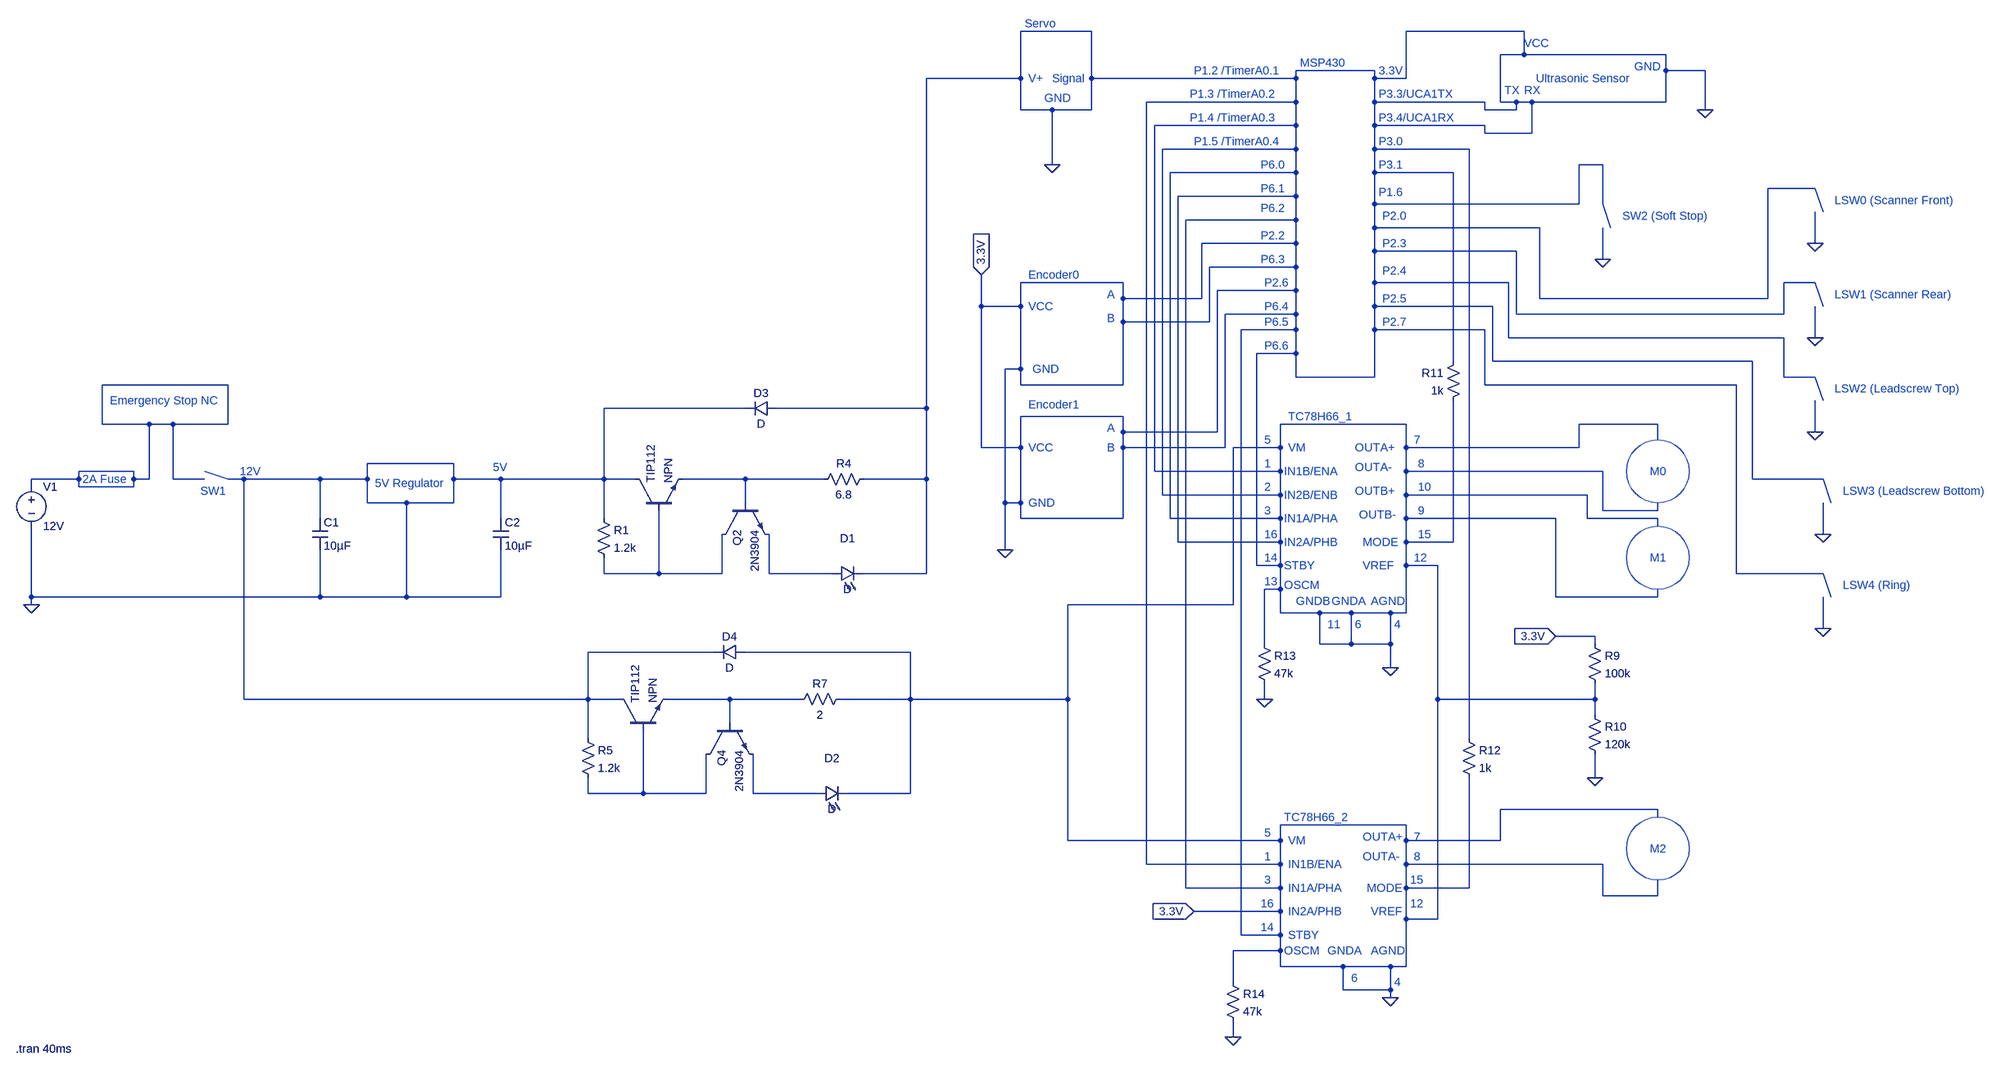
[diagram p0: schematic Project Schematic.asc]
Project Schematic.asc, the LTspice schematic file:
Version 4
SHEET 1 3408 1300
WIRE 1568 -880 1424 -880
WIRE 2448 -880 2208 -880
WIRE 2448 -832 2448 -880
WIRE 2448 -832 2400 -832
WIRE 2736 -832 2448 -832
WIRE 2144 -800 1984 -800
WIRE 2736 -800 2736 -832
WIRE 2816 -800 2736 -800
WIRE 1424 -784 1424 -880
WIRE 1424 -784 1232 -784
WIRE 1568 -784 1568 -880
WIRE 1984 -784 1984 -800
WIRE 1984 -784 1568 -784
WIRE 2144 -784 2144 -800
WIRE 2208 -784 2208 -880
WIRE 2208 -784 2144 -784
WIRE 1984 -736 1984 -784
WIRE 1984 -736 1680 -736
WIRE 2144 -736 2144 -784
WIRE 2368 -736 2144 -736
WIRE 2400 -736 2400 -832
WIRE 2432 -736 2400 -736
WIRE 2464 -736 2432 -736
WIRE 2736 -736 2736 -800
WIRE 2736 -736 2464 -736
WIRE 1424 -720 1424 -784
WIRE 1488 -720 1424 -720
WIRE 1568 -720 1568 -784
WIRE 1568 -720 1488 -720
WIRE 2368 -720 2368 -736
WIRE 2432 -720 2432 -736
WIRE 2432 -720 2368 -720
WIRE 2816 -720 2816 -800
WIRE 1984 -688 1984 -736
WIRE 1984 -688 1696 -688
WIRE 2144 -688 2144 -736
WIRE 2368 -688 2144 -688
WIRE 2368 -672 2368 -688
WIRE 2464 -672 2464 -736
WIRE 2464 -672 2368 -672
WIRE 1984 -640 1984 -688
WIRE 1984 -640 1712 -640
WIRE 2144 -640 2144 -688
WIRE 2336 -640 2144 -640
WIRE 1488 -608 1488 -720
WIRE 2608 -608 2560 -608
WIRE 1984 -592 1984 -640
WIRE 1984 -592 1728 -592
WIRE 2144 -592 2144 -640
WIRE 2304 -592 2144 -592
WIRE 3040 -560 2944 -560
WIRE 1984 -544 1984 -592
WIRE 1984 -544 1744 -544
WIRE 2144 -528 2144 -592
WIRE 2560 -528 2560 -608
WIRE 2560 -528 2144 -528
WIRE 2608 -528 2608 -608
WIRE 3056 -512 3040 -560
WIRE 1984 -496 1984 -544
WIRE 1984 -496 1760 -496
WIRE 2144 -480 2144 -528
WIRE 2480 -480 2144 -480
WIRE 2624 -480 2608 -528
WIRE 1984 -448 1984 -496
WIRE 1984 -448 1792 -448
WIRE 3040 -448 3040 -512
WIRE 2144 -432 2144 -480
WIRE 2432 -432 2144 -432
WIRE 2608 -416 2608 -480
WIRE 1984 -400 1984 -448
WIRE 1984 -400 1808 -400
WIRE 1632 -368 1424 -368
WIRE 2144 -368 2144 -432
WIRE 2416 -368 2144 -368
WIRE 3040 -368 2976 -368
WIRE 1984 -352 1984 -400
WIRE 1984 -352 1824 -352
WIRE 1632 -336 1632 -368
WIRE 1792 -336 1792 -448
WIRE 1792 -336 1632 -336
WIRE 2480 -336 2480 -480
WIRE 2944 -336 2944 -560
WIRE 2944 -336 2480 -336
WIRE 1344 -320 1344 -384
WIRE 1424 -320 1424 -368
WIRE 1424 -320 1344 -320
WIRE 2144 -320 2144 -368
WIRE 2384 -320 2144 -320
WIRE 3056 -320 3040 -368
WIRE 1984 -304 1984 -352
WIRE 1984 -304 1840 -304
WIRE 2432 -304 2432 -432
WIRE 2976 -304 2976 -368
WIRE 2976 -304 2432 -304
WIRE 1632 -288 1632 -336
WIRE 1808 -288 1808 -400
WIRE 1808 -288 1632 -288
WIRE 1984 -272 1984 -304
WIRE 1984 -272 1872 -272
WIRE 2144 -272 2144 -320
WIRE 2368 -272 2144 -272
WIRE 2416 -256 2416 -368
WIRE 2976 -256 2416 -256
WIRE 3040 -256 3040 -320
WIRE 1984 -224 1984 -272
WIRE 1984 -224 1904 -224
WIRE 2304 -208 2304 -592
WIRE 2384 -208 2384 -320
WIRE 2912 -208 2384 -208
WIRE 1424 -192 1424 -320
WIRE 1424 -192 1392 -192
WIRE 1984 -176 1984 -224
WIRE 2144 -176 2144 -272
WIRE 2144 -176 1984 -176
WIRE 2976 -176 2976 -256
WIRE 3040 -176 2976 -176
WIRE -240 -160 -496 -160
WIRE 1424 -160 1424 -192
WIRE 1632 -160 1632 -288
WIRE 1632 -160 1424 -160
WIRE 2368 -160 2368 -272
WIRE 2880 -160 2368 -160
WIRE 3056 -128 3040 -176
WIRE 864 -112 576 -112
WIRE 1232 -112 1232 -784
WIRE 1232 -112 928 -112
WIRE 1632 -96 1424 -96
WIRE -496 -80 -496 -160
WIRE -400 -80 -496 -80
WIRE -352 -80 -400 -80
WIRE -240 -80 -240 -160
WIRE -240 -80 -352 -80
WIRE 2208 -80 1952 -80
WIRE 2720 -80 2560 -80
WIRE 1632 -64 1632 -96
WIRE 1824 -64 1824 -352
WIRE 1824 -64 1632 -64
WIRE 3040 -64 3040 -128
WIRE 2720 -48 2720 -80
WIRE 1344 -32 1344 -320
WIRE 1424 -32 1424 -96
WIRE 1424 -32 1344 -32
WIRE 1632 -32 1632 -64
WIRE 1840 -32 1840 -304
WIRE 1840 -32 1632 -32
WIRE 1952 -32 1952 -80
WIRE 1952 -32 1856 -32
WIRE 2208 -32 2208 -80
WIRE 2560 -32 2560 -80
WIRE 2560 -32 2208 -32
WIRE 224 0 48 0
WIRE -432 16 -544 16
WIRE 1696 16 1696 -688
WIRE 1952 16 1952 -32
WIRE 1952 16 1696 16
WIRE 2208 16 2208 -32
WIRE 2608 16 2208 16
WIRE -544 32 -544 16
WIRE -544 32 -640 32
WIRE -432 32 -432 16
WIRE -400 32 -400 -80
WIRE -400 32 -432 32
WIRE -352 32 -352 -80
WIRE -288 32 -352 32
WIRE -240 32 -288 16
WIRE -208 32 -240 32
WIRE -48 32 -208 32
WIRE 48 32 48 0
WIRE 48 32 -48 32
WIRE 224 32 224 0
WIRE 320 32 224 32
WIRE 576 32 576 -112
WIRE 576 32 320 32
WIRE 640 32 576 32
WIRE 864 32 736 32
WIRE 1024 32 864 32
WIRE 1232 32 1232 -112
WIRE 1232 32 1104 32
WIRE 2912 32 2912 -208
WIRE 3056 32 2912 32
WIRE -640 48 -640 32
WIRE -544 48 -544 32
WIRE -432 48 -432 32
WIRE -432 48 -544 48
WIRE 1712 64 1712 -640
WIRE 1952 64 1952 16
WIRE 1952 64 1712 64
WIRE 2208 64 2208 16
WIRE 2576 64 2208 64
WIRE 48 80 48 32
WIRE 128 80 48 80
WIRE 224 80 224 32
WIRE 224 80 128 80
WIRE 864 80 864 32
WIRE 1392 80 1392 -192
WIRE 1424 80 1424 -32
WIRE 1424 80 1392 80
WIRE 3072 80 3056 32
WIRE 2608 96 2608 16
WIRE 2720 96 2720 80
WIRE 2720 96 2608 96
WIRE -48 112 -48 32
WIRE 320 112 320 32
WIRE 576 112 576 32
WIRE 1424 112 1424 80
WIRE 1632 112 1632 -32
WIRE 1632 112 1424 112
WIRE 1728 112 1728 -592
WIRE 1952 112 1952 64
WIRE 1952 112 1728 112
WIRE 2208 112 2208 64
WIRE 2512 112 2208 112
WIRE 2576 112 2576 64
WIRE 2720 112 2576 112
WIRE 2720 128 2720 112
WIRE 3056 144 3056 80
WIRE 1744 160 1744 -544
WIRE 1952 160 1952 112
WIRE 1952 160 1744 160
WIRE 2208 160 2208 112
WIRE 2304 160 2304 -128
WIRE 2304 160 2208 160
WIRE 1392 176 1392 80
WIRE 1904 208 1904 -224
WIRE 1952 208 1952 160
WIRE 1952 208 1904 208
WIRE 2208 208 2208 160
WIRE 2272 208 2208 208
WIRE 576 224 576 192
WIRE 688 224 688 96
WIRE 688 224 576 224
WIRE 816 224 816 144
WIRE 816 224 688 224
WIRE 912 224 912 144
WIRE 1040 224 912 224
WIRE 1232 224 1232 32
WIRE 1232 224 1104 224
WIRE 2880 224 2880 -160
WIRE 3056 224 2880 224
WIRE 1952 256 1952 208
WIRE 1952 256 1920 256
WIRE -640 272 -640 128
WIRE -48 272 -48 176
WIRE -48 272 -640 272
WIRE 128 272 128 80
WIRE 128 272 -48 272
WIRE 320 272 320 176
WIRE 320 272 128 272
WIRE 2512 272 2512 112
WIRE 2720 272 2720 256
WIRE 2720 272 2512 272
WIRE 3072 272 3056 224
WIRE -640 288 -640 272
WIRE 1856 288 1856 -32
WIRE 1856 288 1520 288
WIRE 1952 304 1952 256
WIRE 2032 304 1952 304
WIRE 2096 304 2032 304
WIRE 2176 304 2096 304
WIRE 2208 304 2208 208
WIRE 2208 304 2176 304
WIRE 3056 336 3056 272
WIRE 2592 352 2512 352
WIRE 1920 368 1920 256
WIRE 2032 368 2032 304
WIRE 2096 368 2096 304
WIRE 2096 368 2032 368
WIRE 2176 368 2176 304
WIRE 2176 368 2096 368
WIRE 2592 368 2592 352
WIRE 800 384 544 384
WIRE 1200 384 864 384
WIRE 2176 416 2176 368
WIRE -208 480 -208 32
WIRE 544 480 544 384
WIRE 544 480 -208 480
WIRE 608 480 544 480
WIRE 832 480 704 480
WIRE 976 480 832 480
WIRE 1200 480 1200 384
WIRE 1200 480 1056 480
WIRE 1520 480 1520 288
WIRE 1520 480 1200 480
WIRE 1920 480 1920 448
WIRE 2272 480 2272 208
WIRE 2592 480 2592 448
WIRE 2592 480 2272 480
WIRE 2592 512 2592 480
WIRE 832 528 832 480
WIRE 544 560 544 480
WIRE 2336 560 2336 -640
WIRE 2592 640 2592 592
WIRE 544 672 544 640
WIRE 656 672 656 544
WIRE 656 672 544 672
WIRE 784 672 784 592
WIRE 784 672 656 672
WIRE 880 672 880 592
WIRE 1008 672 880 672
WIRE 1200 672 1200 480
WIRE 1200 672 1072 672
WIRE 2720 704 2400 704
WIRE 2720 720 2720 704
WIRE 2208 736 1952 736
WIRE 1520 768 1520 480
WIRE 1952 768 1952 736
WIRE 1952 768 1520 768
WIRE 2208 768 2208 736
WIRE 2400 768 2400 704
WIRE 2400 768 2208 768
WIRE 1680 816 1680 -736
WIRE 1952 816 1952 768
WIRE 1952 816 1680 816
WIRE 2208 816 2208 768
WIRE 2608 816 2208 816
WIRE 1760 864 1760 -496
WIRE 1952 864 1952 816
WIRE 1952 864 1760 864
WIRE 2208 864 2208 816
WIRE 2336 864 2336 640
WIRE 2336 864 2208 864
WIRE 2608 880 2608 816
WIRE 2720 880 2720 848
WIRE 2720 880 2608 880
WIRE 1952 912 1952 864
WIRE 1952 912 1776 912
WIRE 2208 928 2208 864
WIRE 2272 928 2272 480
WIRE 2272 928 2208 928
WIRE 1872 960 1872 -272
WIRE 1952 960 1952 912
WIRE 1952 960 1872 960
WIRE 1952 992 1952 960
WIRE 1952 992 1856 992
WIRE 1952 1024 1952 992
WIRE 2080 1024 1952 1024
WIRE 2176 1024 2080 1024
WIRE 2208 1024 2208 928
WIRE 2208 1024 2176 1024
WIRE 1856 1056 1856 992
WIRE 2080 1072 2080 1024
WIRE 2176 1072 2176 1024
WIRE 2176 1072 2080 1072
WIRE 2176 1088 2176 1072
WIRE 1856 1168 1856 1136
FLAG -640 288 0
FLAG 2816 -720 0
FLAG 1488 -608 0
FLAG 2176 416 0
FLAG 2176 1088 0
FLAG 1776 912 3.3V
IOPIN 1776 912 In
FLAG 2512 352 3.3V
IOPIN 2512 352 In
FLAG 2592 640 0
FLAG 2608 -416 0
FLAG 3040 -448 0
FLAG 3040 -256 0
FLAG 3040 -64 0
FLAG 3056 144 0
FLAG 3056 336 0
FLAG 1920 480 0
FLAG 1856 1168 0
FLAG 1344 -384 3.3V
IOPIN 1344 -384 In
FLAG 1392 176 0
SYMBOL voltage -640 32 R0
WINDOW 123 0 0 Left 0
WINDOW 39 0 0 Left 0
SYMATTR InstName V1
SYMATTR Value 12V
SYMBOL cap -64 112 R0
SYMATTR InstName C1
SYMATTR Value 10µF
SYMBOL cap 304 112 R0
SYMATTR InstName C2
SYMATTR Value 10µF
SYMBOL npn 640 96 R270
SYMATTR InstName TIP112
SYMBOL npn 816 80 M90
SYMATTR InstName Q2
SYMATTR Value 2N3904
SYMBOL res 560 96 R0
SYMATTR InstName R1
SYMATTR Value 1.2k
SYMBOL LED 1040 240 R270
WINDOW 0 72 32 VTop 2
WINDOW 3 0 32 VBottom 2
SYMATTR InstName D1
SYMBOL res 1120 16 R90
WINDOW 0 0 56 VBottom 2
WINDOW 3 32 56 VTop 2
SYMATTR InstName R4
SYMATTR Value 6.8
SYMBOL npn 608 544 R270
SYMATTR InstName TIP112
SYMBOL npn 784 528 M90
SYMATTR InstName Q4
SYMATTR Value 2N3904
SYMBOL res 528 544 R0
SYMATTR InstName R5
SYMATTR Value 1.2k
SYMBOL LED 1008 688 R270
WINDOW 0 72 32 VTop 2
WINDOW 3 0 32 VBottom 2
SYMATTR InstName D2
SYMBOL res 1072 464 R90
WINDOW 0 0 56 VBottom 2
WINDOW 3 32 56 VTop 2
SYMATTR InstName R7
SYMATTR Value 2
SYMBOL res 2576 352 R0
SYMATTR InstName R9
SYMATTR Value 100k
SYMBOL res 2576 496 R0
SYMATTR InstName R10
SYMATTR Value 120k
SYMBOL res 2320 -224 M0
SYMATTR InstName R11
SYMATTR Value 1k
SYMBOL res 2320 544 R0
SYMATTR InstName R12
SYMATTR Value 1k
SYMBOL res 1904 352 R0
SYMATTR InstName R13
SYMATTR Value 47k
SYMBOL res 1840 1040 R0
SYMATTR InstName R14
SYMATTR Value 47k
SYMBOL diode 928 -128 R90
WINDOW 0 0 32 VBottom 2
WINDOW 3 32 32 VTop 2
SYMATTR InstName D3
SYMBOL diode 864 368 R90
WINDOW 0 0 32 VBottom 2
WINDOW 3 32 32 VTop 2
SYMATTR InstName D4
TEXT 1992 -816 Left 2 ;MSP430
TEXT 64 40 Left 2 ;5V Regulator
TEXT 1432 -896 Left 2 ;Servo
TEXT 1440 -784 Left 2 ;V+
TEXT 1472 -744 Left 2 ;GND
TEXT 1488 -784 Left 2 ;Signal
TEXT 1776 -800 Left 2 ;P1.2 /TimerA0.1
TEXT 2472 -784 Left 2 ;Ultrasonic Sensor
TEXT 2152 -800 Left 2 ;3.3V
TEXT 2448 -856 Left 2 ;VCC
TEXT 2152 -752 Left 2 ;P3.3/UCA1TX
TEXT 2152 -704 Left 2 ;P3.4/UCA1RX
TEXT 2408 -760 Left 2 ;TX
TEXT 2448 -760 Left 2 ;RX
TEXT 2672 -808 Left 2 ;GND
TEXT 1968 -96 Left 2 ;TC78H66_1
TEXT 1960 720 Left 2 ;TC78H66_2
TEXT 1920 -48 Left 2 ;5
TEXT 1920 752 Left 2 ;5
TEXT 1968 -32 Left 2 ;VM
TEXT 1968 768 Left 2 ;VM
TEXT 2136 280 Left 2 ;AGND
TEXT 2136 992 Left 2 ;AGND
TEXT 2184 328 Left 2 ;4
TEXT 2184 1056 Left 2 ;4
TEXT 2104 328 Left 2 ;6
TEXT 2048 328 Left 2 ;11
TEXT 2096 1048 Left 2 ;6
TEXT 2056 280 Left 2 ;GNDA
TEXT 1984 280 Left 2 ;GNDB
TEXT 2048 992 Left 2 ;GNDA
TEXT 2104 -32 Left 2 ;OUTA+
TEXT 2104 8 Left 2 ;OUTA-
TEXT 2104 56 Left 2 ;OUTB+
TEXT 2112 104 Left 2 ;OUTB-
TEXT 2704 16 Left 2 ;M0
TEXT 2704 192 Left 2 ;M1
TEXT 2704 784 Left 2 ;M2
TEXT 2120 760 Left 2 ;OUTA+
TEXT 2120 800 Left 2 ;OUTA-
TEXT 2224 -48 Left 2 ;7
TEXT 2232 0 Left 2 ;8
TEXT 2232 48 Left 2 ;10
TEXT 2232 96 Left 2 ;9
TEXT 2224 760 Left 2 ;7
TEXT 2224 800 Left 2 ;8
TEXT 1768 -752 Left 2 ;P1.3 /TimerA0.2
TEXT 1768 -704 Left 2 ;P1.4 /TimerA0.3
TEXT 1776 -656 Left 2 ;P1.5 /TimerA0.4
TEXT 1920 0 Left 2 ;1
TEXT 1920 48 Left 2 ;2
TEXT 1960 16 Left 2 ;IN1B/ENA
TEXT 1960 64 Left 2 ;IN2B/ENB
TEXT 1968 816 Left 2 ;IN1B/ENA
TEXT 1920 800 Left 2 ;1
TEXT 1960 112 Left 2 ;IN1A/PHA
TEXT 1960 160 Left 2 ;IN2A/PHB
TEXT 1920 96 Left 2 ;3
TEXT 1920 144 Left 2 ;16
TEXT 1912 -608 Left 2 ;P6.0
TEXT 1912 -560 Left 2 ;P6.1
TEXT 1968 864 Left 2 ;IN1A/PHA
TEXT 1968 912 Left 2 ;IN2A/PHB
TEXT 1912 -520 Left 2 ;P6.2
TEXT 2120 160 Left 2 ;MODE
TEXT 2128 864 Left 2 ;MODE
TEXT 2232 144 Left 2 ;15
TEXT 2216 848 Left 2 ;15
TEXT 1920 848 Left 2 ;3
TEXT 1912 896 Left 2 ;16
TEXT 2152 -656 Left 2 ;P3.0
TEXT 2152 -608 Left 2 ;P3.1
TEXT 2120 208 Left 2 ;VREF
TEXT 2136 912 Left 2 ;VREF
TEXT 2216 896 Left 2 ;12
TEXT 2224 192 Left 2 ;12
TEXT -480 -128 Left 2 ;Emergency Stop NC
TEXT -296 56 Left 2 ;SW1
TEXT 2152 -552 Left 2 ;P1.6
TEXT 2648 -504 Left 2 ;SW2 (Soft Stop)
TEXT 3080 -536 Left 2 ;LSW0 (Scanner Front)
TEXT 3080 -344 Left 2 ;LSW1 (Scanner Rear)
TEXT 3080 -152 Left 2 ;LSW2 (Leadscrew Top)
TEXT 3096 56 Left 2 ;LSW3 (Leadscrew Bottom)
TEXT 3096 248 Left 2 ;LSW4 (Ring)
TEXT 2160 -504 Left 2 ;P2.0
TEXT 2160 -448 Left 2 ;P2.3
TEXT 2160 -392 Left 2 ;P2.4
TEXT 2160 -336 Left 2 ;P2.5
TEXT 2160 -288 Left 2 ;P2.7
TEXT 1968 960 Left 2 ;STBY
TEXT 1960 208 Left 2 ;STBY
TEXT 1912 944 Left 2 ;14
TEXT 1920 192 Left 2 ;14
TEXT 1960 248 Left 2 ;OSCM
TEXT 1920 240 Left 2 ;13
TEXT 1960 992 Left 2 ;OSCM
TEXT -536 32 Left 2 ;2A Fuse
TEXT 1440 -384 Left 2 ;Encoder0
TEXT 1440 -120 Left 2 ;Encoder1
TEXT 1440 -320 Left 2 ;VCC
TEXT 1440 -32 Left 2 ;VCC
TEXT 1448 -192 Left 2 ;GND
TEXT 1440 80 Left 2 ;GND
TEXT 1912 -464 Left 2 ;P2.2
TEXT 1920 -368 Left 2 ;P2.6
TEXT 1912 -416 Left 2 ;P6.3
TEXT 1920 -320 Left 2 ;P6.4
TEXT 1600 -344 Left 2 ;A
TEXT 1600 -296 Left 2 ;B
TEXT 1600 -72 Left 2 ;A
TEXT 1600 -32 Left 2 ;B
TEXT 1920 -288 Left 2 ;P6.5
TEXT 1920 -240 Left 2 ;P6.6
TEXT -672 1192 Left 2 !.tran 40ms
TEXT -216 16 Left 2 ;12V
TEXT 304 8 Left 2 ;5V
CIRCLE Normal 2784 80 2656 -48
CIRCLE Normal 2784 256 2656 128
CIRCLE Normal 2784 848 2656 720

The netlist it stands for:
* Project Schematic.asc
V1 N001 0 12V
C1 0 0 10µF
C2 0 0 10µF
Q§TIP112 0 N003 N002 0 NPN
Q2 N003 N002 N004 0 2N3904
R1 0 N003 1.2k
D1 N004 0 D
R4 0 N002 6.8
Q§TIP112 0 N006 N005 0 NPN
Q4 N006 N005 N007 0 2N3904
R5 0 N006 1.2k
D2 N007 0 D
R7 0 N005 2
R9 0 0 100k
R10 0 0 120k
R11 0 0 1k
R12 0 0 1k
R13 0 0 47k
R14 0 0 47k
D3 0 0 D
D4 0 0 D
.model D D
.lib standard.dio
.model NPN NPN
.model PNP PNP
.lib standard.bjt
* MSP430
* 5V Regulator
* Servo
* V+
* GND
* Signal
* P1.2 /TimerA0.1
* Ultrasonic Sensor
* 3.3V
* VCC
* P3.3/UCA1TX
* P3.4/UCA1RX
* TX
* RX
* GND
* TC78H66_1
* TC78H66_2
* 5
* 5
* VM
* VM
* AGND
* AGND
* 4
* 4
* 6
* 11
* 6
* GNDA
* GNDB
* GNDA
* OUTA+
* OUTA-
* OUTB+
* OUTB-
* M0
* M1
* M2
* OUTA+
* OUTA-
* 7
* 8
* 10
* 9
* 7
* 8
* P1.3 /TimerA0.2
* P1.4 /TimerA0.3
* P1.5 /TimerA0.4
* 1
* 2
* IN1B/ENA
* IN2B/ENB
* IN1B/ENA
* 1
* IN1A/PHA
* IN2A/PHB
* 3
* 16
* P6.0
* P6.1
* IN1A/PHA
* IN2A/PHB
* P6.2
* MODE
* MODE
* 15
* 15
* 3
* 16
* P3.0
* P3.1
* VREF
* VREF
* 12
* 12
* Emergency Stop NC
* SW1
* P1.6
* SW2 (Soft Stop)
* LSW0 (Scanner Front)
* LSW1 (Scanner Rear)
* LSW2 (Leadscrew Top)
* LSW3 (Leadscrew Bottom)
* LSW4 (Ring)
* P2.0
* P2.3
* P2.4
* P2.5
* P2.7
* STBY
* STBY
* 14
* 14
* OSCM
* 13
* OSCM
* 2A Fuse
* Encoder0
* Encoder1
* VCC
* VCC
* GND
* GND
* P2.2
* P2.6
* P6.3
* P6.4
* A
* B
* A
* B
* P6.5
* P6.6
.tran 40ms
* 12V
* 5V
.backanno
.end